# EAGLE design prot-pic24-mtouch+tft-rev2 (EAGLE 6.2)
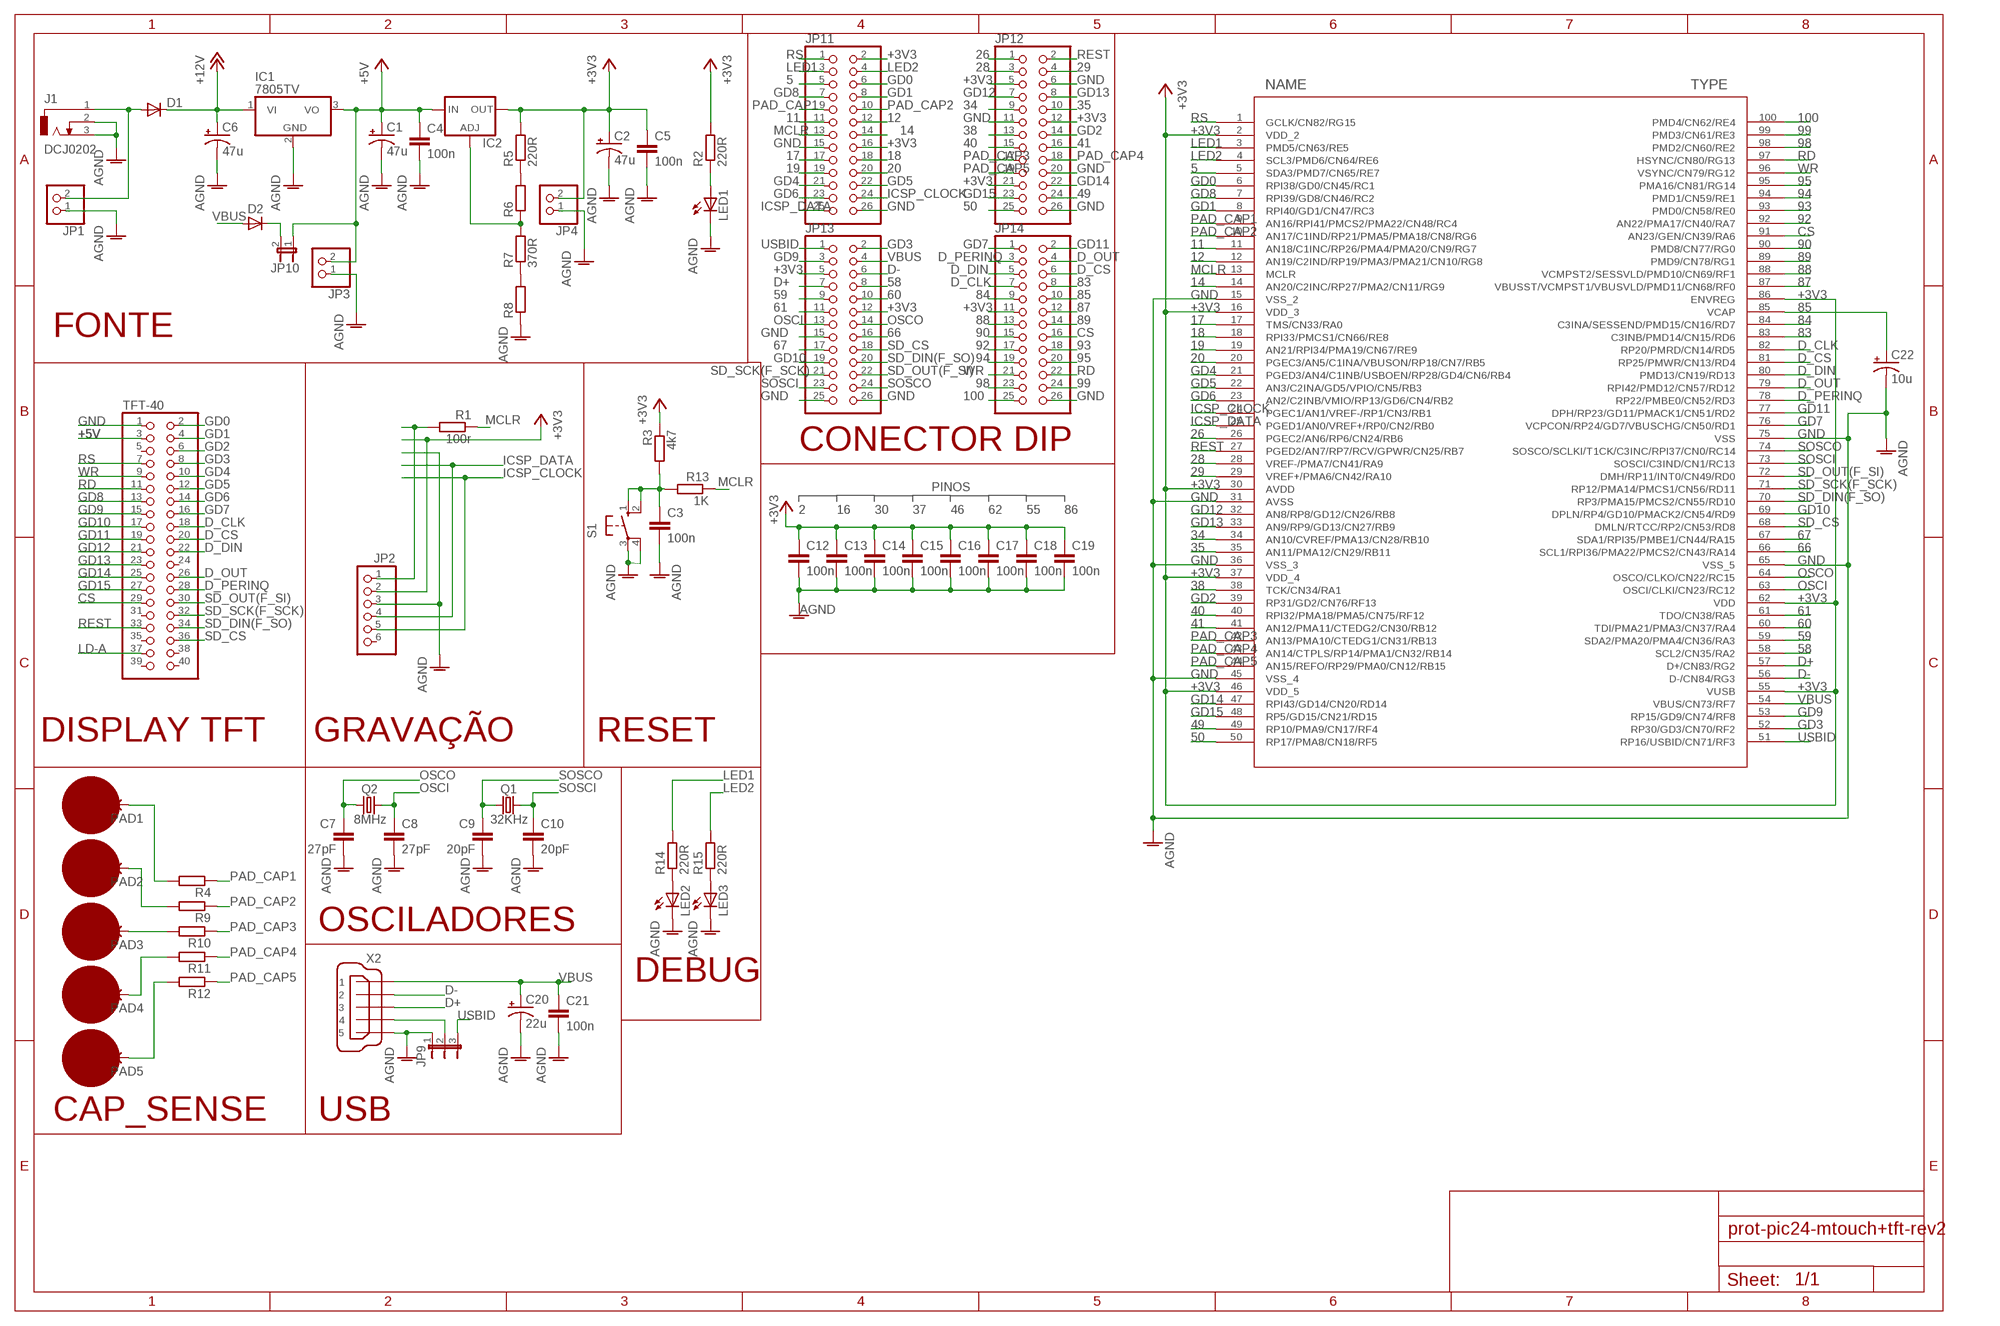
[diagram p0: schematic, sheet 1]

## Parts
C1  47u  CPOL-USE2.5-5  [E2,5-5]
C2  47u  CPOL-USE2.5-5  [E2,5-5]
C3  100n  C-EU050-025X075  [C050-025X075]
C4  100n  C-EU025-030X050  [C025-030X050]
C5  100n  C-EU025-030X050  [C025-030X050]
C6  47u  CPOL-USE2.5-5  [E2,5-5]
C7  27pF  C-EU025-030X050  [C025-030X050]
C8  27pF  C-EU025-030X050  [C025-030X050]
C9  20pF  C-EU025-030X050  [C025-030X050]
C10  20pF  C-EU025-030X050  [C025-030X050]
C12  100n  C-EU025-025X050  [C025-025X050]
C13  100n  C-EU025-030X050  [C025-030X050]
C14  100n  C-EU025-030X050  [C025-030X050]
C15  100n  C-EU025-030X050  [C025-030X050]
C16  100n  C-EU025-030X050  [C025-030X050]
C17  100n  C-EU025-030X050  [C025-030X050]
C18  100n  C-EU025-030X050  [C025-030X050]
C19  100n  C-EU025-030X050  [C025-030X050]
C20  22u  CPOL-USE2.5-5  [E2,5-5]
C21  100n  C-EU025-030X050  [C025-030X050]
C22  10u  CPOL-USE2.5-5  [E2,5-5]
D1  DIODE-D-5  [D-5]
D2  DIODE-D-5  [D-5]
IC1  7805TV  [TO220V]
IC2  LM317TS  [317TS]
J1  DCJ0202  [DCJ0202]
JP1  PINHD-1X2  [1X02]
JP2  PINHD-1X6  [1X06]
JP3  PINHD-1X2  [1X02]
JP4  PINHD-1X2  [1X02]
JP9  JP2E  [JP2]
JP10  JP1E  [JP1]
JP11  PINHD-2X13  [2X13]
JP12  PINHD-2X13  [2X13]
JP13  PINHD-2X13  [2X13]
JP14  PINHD-2X13  [2X13]
LED1  LED3MM  [LED3MM]
LED2  LED3MM  [LED3MM]
LED3  LED3MM  [LED3MM]
PAD1  SMD5  [SMD2,54-5,08]
PAD2  SMD5  [SMD2,54-5,08]
PAD3  SMD5  [SMD2,54-5,08]
PAD4  SMD5  [SMD2,54-5,08]
PAD5  SMD5  [SMD2,54-5,08]
Q1  32KHz  CRYSTALTC26V  [TC26V]
Q2  8MHz  CRYSTALHC49S  [HC49/S]
R1  100r  R-EU_0204/2V  [0204V]
R2  220R  R-EU_0204/2V  [0204V]
R3  4k7  R-EU_0204/2V  [0204V]
R4  220R  R-EU_0204/2V  [0204V]
R5  220R  R-EU_0204/2V  [0204V]
R6  R-EU_0204/2V  [0204V]
R7  370R  R-EU_0204/2V  [0204V]
R8  R-EU_0204/2V  [0204V]
R9  220R  R-EU_0204/2V  [0204V]
R10  220R  R-EU_0204/2V  [0204V]
R11  220R  R-EU_0204/2V  [0204V]
R12  220R  R-EU_0204/2V  [0204V]
R13  1K  R-EU_0204/2V  [0204V]
R14  220R  R-EU_0204/2V  [0204V]
R15  220R  R-EU_0204/2V  [0204V]
S1  10-XX  [B3F-10XX]
TFT-40  PINHD-2X20  [2X20]
U$1  PIC24FJXXXDAX10_  [TQFP100_12X12MC]
X2  MINI-USB-32005-301  [32005-301]

## Nets
5: JP11.5 U$1.5(SDA3/PMD7/CN65/RE7)
11: JP11.11 U$1.11(AN18/C1INC/RP26/PMA4/PMA20/CN9/RG7)
12: JP11.12 U$1.12(AN19/C2IND/RP19/PMA3/PMA21/CN10/RG8)
14: JP11.14 U$1.14(AN20/C2INC/RP27/PMA2/CN11/RG9)
17: JP11.17 U$1.17(TMS/CN33/RA0)
18: JP11.18 U$1.18(RPI33/PMCS1/CN66/RE8)
19: JP11.19 U$1.19(AN21/RPI34/PMA19/CN67/RE9)
20: JP11.20 U$1.20(PGEC3/AN5/C1INA/VBUSON/RP18/CN7/RB5)
26: JP12.1 U$1.26(PGEC2/AN6/RP6/CN24/RB6)
28: JP12.3 U$1.28(VREF-/PMA7/CN41/RA9)
29: JP12.4 U$1.29(VREF+/PMA6/CN42/RA10)
34: JP12.9 U$1.34(AN10/CVREF/PMA13/CN28/RB10)
35: JP12.10 U$1.35(AN11/PMA12/CN29/RB11)
38: JP12.13 U$1.38(TCK/CN34/RA1)
40: JP12.15 U$1.40(RPI32/PMA18/PMA5/CN75/RF12)
41: JP12.16 U$1.41(AN12/PMA11/CTEDG2/CN30/RB12)
49: JP12.24 U$1.49(RP10/PMA9/CN17/RF4)
50: JP12.25 U$1.50(RP17/PMA8/CN18/RF5)
58: JP13.8 U$1.58(SCL2/CN35/RA2)
59: JP13.9 U$1.59(SDA2/PMA20/PMA4/CN36/RA3)
60: JP13.10 U$1.60(TDI/PMA21/PMA3/CN37/RA4)
61: JP13.11 U$1.61(TDO/CN38/RA5)
66: JP13.16 U$1.66(SCL1/RPI36/PMA22/PMCS2/CN43/RA14)
67: JP13.17 U$1.67(SDA1/RPI35/PMBE1/CN44/RA15)
83: JP14.8 U$1.83(C3INB/PMD14/CN15/RD6)
84: JP14.9 U$1.84(C3INA/SESSEND/PMD15/CN16/RD7)
85: C22.+ JP14.10 U$1.85(VCAP)
87: JP14.12 U$1.87(VBUSST/VCMPST1/VBUSVLD/PMD11/CN68/RF0)
88: JP14.13 U$1.88(VCMPST2/SESSVLD/PMD10/CN69/RF1)
89: JP14.14 U$1.89(PMD9/CN78/RG1)
90: JP14.15 U$1.90(PMD8/CN77/RG0)
92: JP14.17 U$1.92(AN22/PMA17/CN40/RA7)
93: JP14.18 U$1.93(PMD0/CN58/RE0)
94: JP14.19 U$1.94(PMD1/CN59/RE1)
95: JP14.20 U$1.95(PMA16/CN81/RG14)
98: JP14.23 U$1.98(PMD2/CN60/RE2)
99: JP14.24 U$1.99(PMD3/CN61/RE3)
100: JP14.25 U$1.100(PMD4/CN62/RE4)
+3V3: C2.+ C5.1 C12.1 C13.1 C14.1 C15.1 C16.1 C17.1 C18.1 C19.1 IC2.2(OUT) JP2.2 JP4.2 JP11.2 JP11.16 JP12.5 JP12.12 JP12.21 JP13.5 JP13.12 JP14.11 R2.2 R3.1 R5.2 U$1.2(VDD_2) U$1.16(VDD_3) U$1.30(AVDD) U$1.37(VDD_4) U$1.46(VDD_5) U$1.55(VUSB) U$1.62(VDD) U$1.86(ENVREG)
+5V: C1.+ C4.1 IC1.3(VO) IC2.3(IN) JP3.2 JP10.1 TFT-40.3
+12V: C6.+ D1.C IC1.1(VI)
AGND: LED2.K(C) LED3.K(C)
CS: JP14.16 TFT-40.29 U$1.91(AN23/GEN/CN39/RA6)
D+: JP13.7 U$1.57(D+/CN83/RG2) X2.3
D-: JP13.6 U$1.56(D-/CN84/RG3) X2.2
D_CLK: JP14.7 TFT-40.18 U$1.82(RP20/PMRD/CN14/RD5)
D_CS: JP14.6 TFT-40.20 U$1.81(RP25/PMWR/CN13/RD4)
D_DIN: JP14.5 TFT-40.22 U$1.80(PMD13/CN19/RD13)
D_OUT: JP14.4 TFT-40.26 U$1.79(RPI42/PMD12/CN57/RD12)
D_PERINQ: JP14.3 TFT-40.28 U$1.78(RP22/PMBE0/CN52/RD3)
GD0: JP11.6 TFT-40.2 U$1.6(RPI38/GD0/CN45/RC1)
GD1: JP11.8 TFT-40.4 U$1.8(RPI40/GD1/CN47/RC3)
GD2: JP12.14 TFT-40.6 U$1.39(RP31/GD2/CN76/RF13)
GD3: JP13.2 TFT-40.8 U$1.52(RP30/GD3/CN70/RF2)
GD4: JP11.21 TFT-40.10 U$1.21(PGED3/AN4/C1INB/USBOEN/RP28/GD4/CN6/RB4)
GD5: JP11.22 TFT-40.12 U$1.22(AN3/C2INA/GD5/VPIO/CN5/RB3)
GD6: JP11.23 TFT-40.14 U$1.23(AN2/C2INB/VMIO/RP13/GD6/CN4/RB2)
GD7: JP14.1 TFT-40.16 U$1.76(VCPCON/RP24/GD7/VBUSCHG/CN50/RD1)
GD8: JP11.7 TFT-40.13 U$1.7(RPI39/GD8/CN46/RC2)
GD9: JP13.3 TFT-40.15 U$1.53(RP15/GD9/CN74/RF8)
GD10: JP13.19 TFT-40.17 U$1.69(DPLN/RP4/GD10/PMACK2/CN54/RD9)
GD11: JP14.2 TFT-40.19 U$1.77(DPH/RP23/GD11/PMACK1/CN51/RD2)
GD12: JP12.7 TFT-40.21 U$1.32(AN8/RP8/GD12/CN26/RB8)
GD13: JP12.8 TFT-40.23 U$1.33(AN9/RP9/GD13/CN27/RB9)
GD14: JP12.22 TFT-40.25 U$1.47(RPI43/GD14/CN20/RD14)
GD15: JP12.23 TFT-40.27 U$1.48(RP5/GD15/CN21/RD15)
GND: C1.- C2.- C3.2 C4.2 C5.2 C6.- C7.2 C8.2 C9.2 C10.2 C12.2 C13.2 C14.2 C15.2 C16.2 C17.2 C18.2 C19.2 C20.- C21.2 C22.- IC1.2(GND) J1.2 J1.3 JP1.1 JP2.3 JP3.1 JP4.1 JP9.1 JP11.15 JP11.26 JP12.6 JP12.11 JP12.20 JP12.26 JP13.15 JP13.25 JP13.26 JP14.26 LED1.K(C) R8.1 S1.3(P) S1.4(P1) TFT-40.1 U$1.15(VSS_2) U$1.31(AVSS) U$1.36(VSS_3) U$1.45(VSS_4) U$1.65(VSS_5) U$1.75(VSS) X2.5 ; supply symbol labelled AGND
ICSP_CLOCK: JP2.5 JP11.24 U$1.24(PGEC1/AN1/VREF-/RP1/CN3/RB1)
ICSP_DATA: JP2.4 JP11.25 U$1.25(PGED1/AN0/VREF+/RP0/CN2/RB0)
LD-A: TFT-40.37
LED1: JP11.3 R14.2 U$1.3(PMD5/CN63/RE5)
LED2: JP11.4 R15.2 U$1.4(SCL3/PMD6/CN64/RE6)
MCLR: JP11.13 R1.1 R13.1 U$1.13(MCLR)
N$1: D1.A J1.1 JP1.2
N$2: LED1.A R2.1
N$3: JP2.1 R1.2
N$4: R5.1 R6.2
N$5: IC2.1(ADJ) R6.1 R7.2
N$6: R7.1 R8.2
N$7: PAD1.1(P) R4.2
N$8: JP9.2 X2.4
N$9: PAD2.1(P) R9.2
N$10: PAD3.1(P) R10.2
N$11: PAD4.1(P) R11.2
N$12: PAD5.1(P) R12.2
N$13: C3.1 R3.2 R13.2 S1.1(S) S1.2(S1)
N$14: LED2.A R14.1
N$15: D2.C JP10.2
N$16: LED3.A R15.1
OSCI: C8.1 JP13.13 Q2.2 U$1.63(OSCI/CLKI/CN23/RC12)
OSCO: C7.1 JP13.14 Q2.1 U$1.64(OSCO/CLKO/CN22/RC15)
PAD_CAP1: JP11.9 R4.1 U$1.9(AN16/RPI41/PMCS2/PMA22/CN48/RC4)
PAD_CAP2: JP11.10 R9.1 U$1.10(AN17/C1IND/RP21/PMA5/PMA18/CN8/RG6)
PAD_CAP3: JP12.17 R10.1 U$1.42(AN13/PMA10/CTEDG1/CN31/RB13)
PAD_CAP4: JP12.18 R11.1 U$1.43(AN14/CTPLS/RP14/PMA1/CN32/RB14)
PAD_CAP5: JP12.19 R12.1 U$1.44(AN15/REFO/RP29/PMA0/CN12/RB15)
RD: JP14.22 TFT-40.11 U$1.97(HSYNC/CN80/RG13)
REST: JP12.2 TFT-40.33 U$1.27(PGED2/AN7/RP7/RCV/GPWR/CN25/RB7)
RS: JP11.1 TFT-40.7 U$1.1(GCLK/CN82/RG15)
SD_CS: JP13.18 TFT-40.36 U$1.68(DMLN/RTCC/RP2/CN53/RD8)
SD_DIN(F_SO): JP13.20 TFT-40.34 U$1.70(RP3/PMA15/PMCS2/CN55/RD10)
SD_OUT(F_SI): JP13.22 TFT-40.30 U$1.72(DMH/RP11/INT0/CN49/RD0)
SD_SCK(F_SCK): JP13.21 TFT-40.32 U$1.71(RP12/PMA14/PMCS1/CN56/RD11)
SOSCI: C10.1 JP13.23 Q1.2 U$1.73(SOSCI/C3IND/CN1/RC13)
SOSCO: C9.1 JP13.24 Q1.1 U$1.74(SOSCO/SCLKI/T1CK/C3INC/RPI37/CN0/RC14)
USBID: JP9.3 JP13.1 U$1.51(RP16/USBID/CN71/RF3)
VBUS: C20.+ C21.1 D2.A JP13.4 U$1.54(VBUS/CN73/RF7) X2.1
WR: JP14.21 TFT-40.9 U$1.96(VSYNC/CN79/RG12)
Unconnected: JP2.6 TFT-40.5 TFT-40.24 TFT-40.31 TFT-40.35 TFT-40.38 TFT-40.39 TFT-40.40

## Notes on the sheet
- FONTE
- CONECTOR DIP
- PINOS
- 2 | 16 | 30 | 37 | 46 | 62 | 55 | 86
- DISPLAY TFT | GRAVAÇÃO | RESET
- OSCILADORES
- DEBUG
- CAP_SENSE | USB

## Library data of the parts
C1 C2 C6 C20 C22 = rcl:CPOL-US: POLARIZED CAPACITOR, American symbol
C3-C5 C7-C10 C12-C19 C21 = rcl:C-EU: CAPACITOR, European symbol
D1 D2 = diode:DIODE-: DIODE
IC1 = linear:78*: Positive VOLTAGE REGULATOR Source: http://cache.national.com/ds/LM/LM78L05.pdf http://www.fairchildsemi.com/ds/LM/LM7805.pdf
IC2 = v-reg:LM317TS: VOLTAGE REGULATOR
J1 = con-jack:DCJ0202: DC POWER JACK Source: DCJ0202.pdf; OC_FARNELL: unknown; OC_NEWARK: unknown
JP1 JP3 JP4 = pinhead:PINHD-1X2: PIN HEADER
JP2 = pinhead:PINHD-1X6: PIN HEADER
JP9 = jumper:JP2E: JUMPER
JP10 = jumper:JP1E: JUMPER
JP11-JP14 = pinhead:PINHD-2X13: PIN HEADER
LED1-LED3 = led:LED: LED OSRAM: - CHIPLED LG R971, LG N971, LY N971, LG Q971, LY Q971, LO R971, LY R971 LH N974, LH R974 LS Q976, LO Q976, LY Q976 LO Q996 - Hyper CHIPLED LW Q18S LB Q993, LB Q99A, LB R99A - SideLED LS A670, LO A670, LY A670, LG A670, LP A670 LB A673, LV A673, LT A673, LW A673 LH A674 LY A675 LS A676, LA A676, LO A676, LY A676, LW A676 LS A679, LY A679, LG A679 - Hyper Micro SIDELED® LS Y876, LA Y876, LO Y876, LY Y876 LT Y87S - SmartLED LW L88C, LW L88S LB L89C, LB L89S, LG L890 LS L89K, LO L89K, LY L89K LS L896, LA L896, LO L896, LY L896 - TOPLED LS T670, LO T670, LY T670, LG T670, LP T670 LSG T670, LSP T670, LSY T670, LOP T670, LYG T670 LG T671, LOG T671, LSG T671 LB T673, LV T673, LT T673, LW T673 LH T674 LS T676, LA T676, LO T676, LY T676, LB T676, LH T676, LSB T676, LW T676 LB T67C, LV T67C, LT T67C, LS T67K, LO T67K, LY T67K, LW E67C LS E67B, LA E67B, LO E67B, LY E67B, LB E67C, LV E67C, LT E67C LW T67C LS T679, LY T679, LG T679 LS T770, LO T770, LY T770, LG T770, LP T770 LB T773, LV T773, LT T773, LW T773 LH T774 LS E675, LA E675, LY E675, LS T675 LS T776, LA T776, LO T776, LY T776, LB T776 LHGB T686 LT T68C, LB T68C - Hyper Mini TOPLED® LB M676 - Mini TOPLED Santana® LG M470 LS M47K, LO M47K, LY M47K Source: http://www.osram.convergy.de LUXEON: - LUMILED® LXK2-PW12-R00, LXK2-PW12-S00, LXK2-PW14-U00, LXK2-PW14-V00 LXK2-PM12-R00, LXK2-PM12-S00, LXK2-PM14-U00 LXK2-PE12-Q00, LXK2-PE12-R00, LXK2-PE12-S00, LXK2-PE14-T00, LXK2-PE14-U00 LXK2-PB12-K00, LXK2-PB12-L00, LXK2-PB12-M00, LXK2-PB14-N00, LXK2-PB14-P00, LXK2-PB14-Q00 LXK2-PR12-L00, LXK2-PR12-M00, LXK2-PR14-Q00, LXK2-PR14-R00 LXK2-PD12-Q00, LXK2-PD12-R00, LXK2-PD12-S00 LXK2-PH12-R00, LXK2-PH12-S00 LXK2-PL12-P00, LXK2-PL12-Q00, LXK2-PL12-R00 Source: www.luxeon.com KINGBRIGHT: KA-3528ASYC Source: www.kingbright.com
PAD1-PAD5 = wirepad:SMD5: SMD PAD
Q1 = crystal:CRYSTAL: CRYSTAL; OC_FARNELL: unknown; OC_NEWARK: unknown
Q2 = crystal:CRYSTAL: CRYSTAL; OC_FARNELL: 1667008; OC_NEWARK: unknown
R1-R15 = rcl:R-EU_: RESISTOR, European symbol
S1 = switch-omron:10-XX: OMRON SWITCH; MPN: B3F-1000; OC_FARNELL: 176432; OC_NEWARK: 36M3542
TFT-40 = pinhead:PINHD-2X20: PIN HEADER
U$1 = PIC24FJ256TESTE:PIC24FJXXXDAX10_
X2 = con-cypressindustries:MINI-USB-: MINI USB-B Conector Source: www.cypressindustries.com; OC_FARNELL: unknown; OC_NEWARK: unknown

## Board
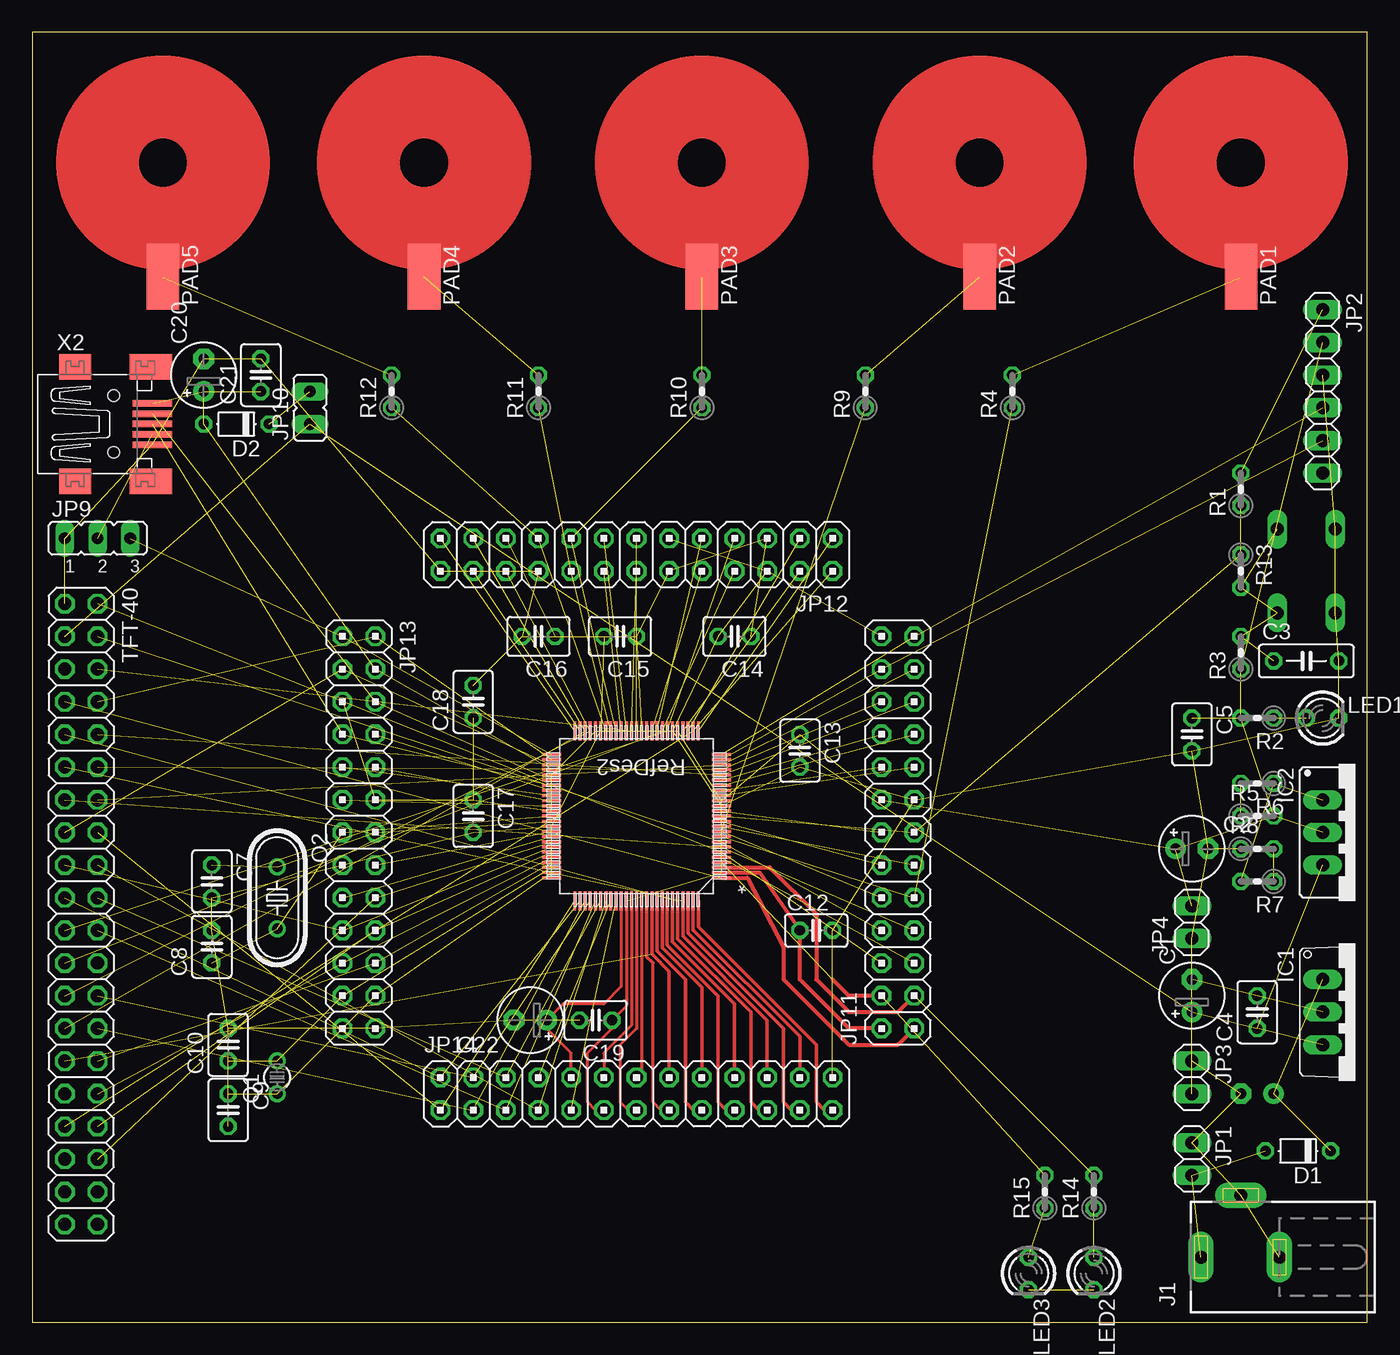
[diagram p1: board, top side]
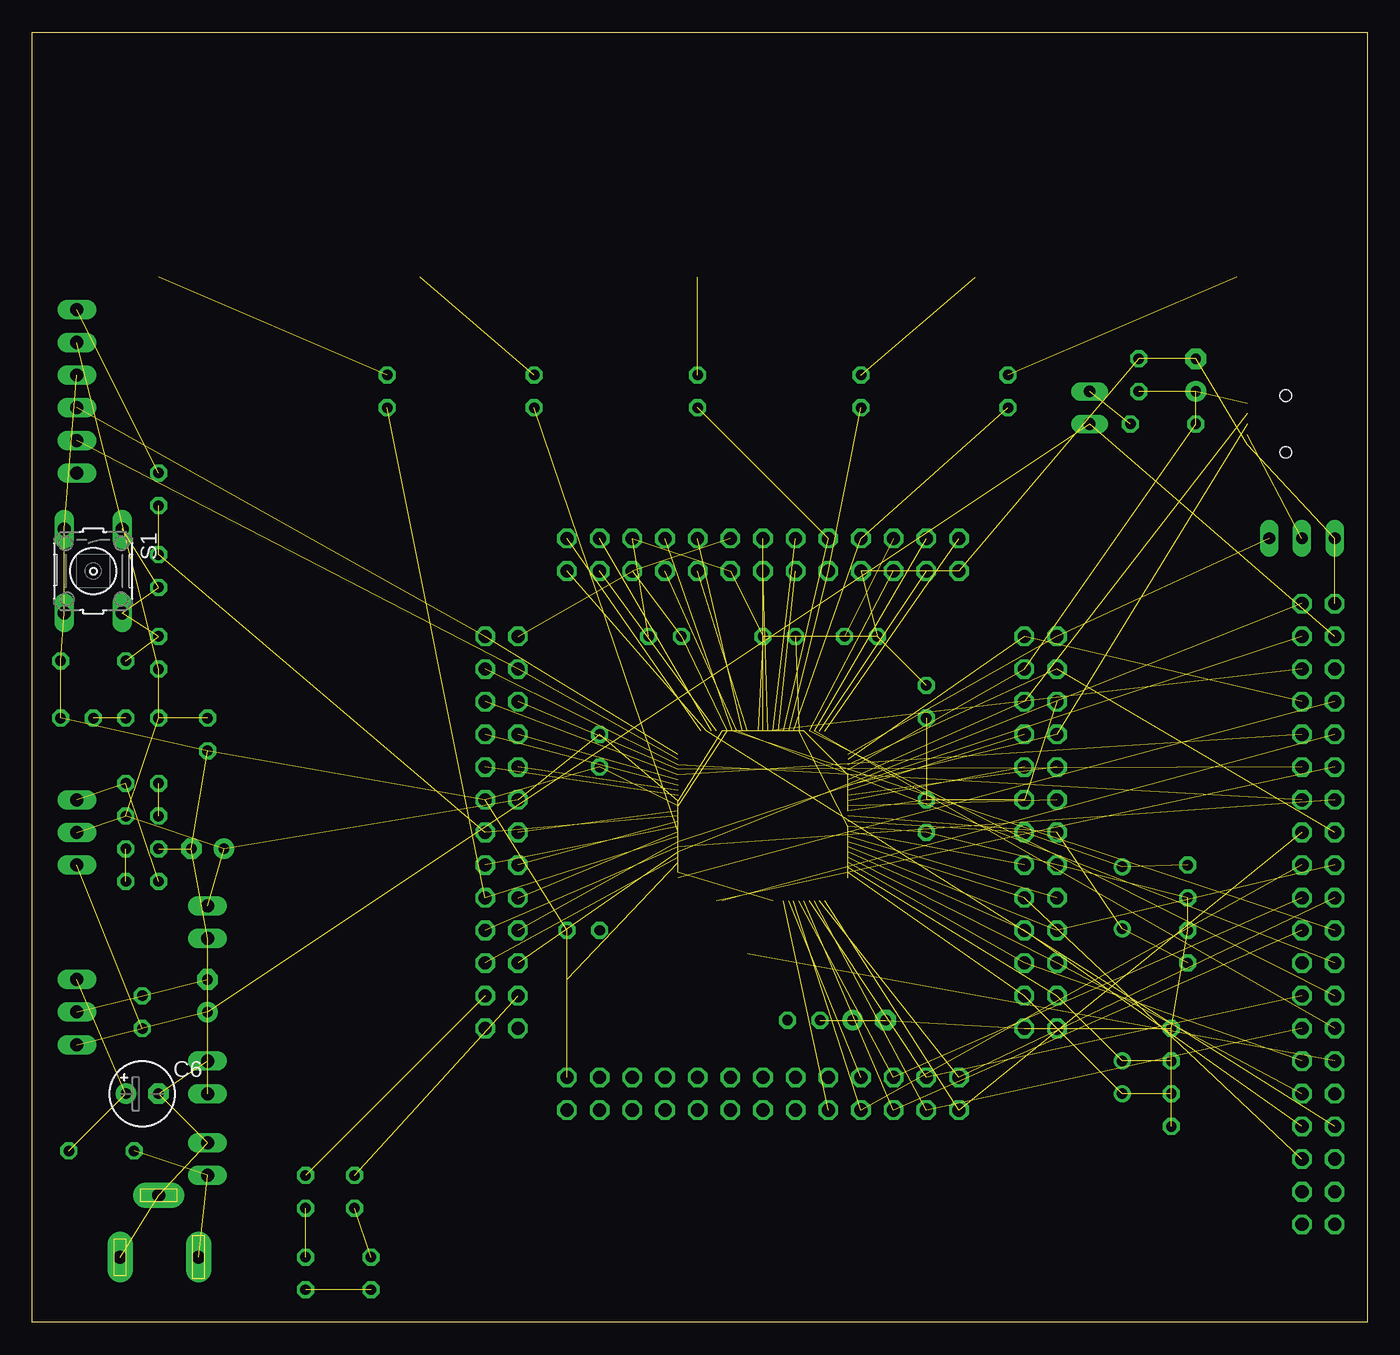
[diagram p2: board, bottom side, seen from below]

Size 103.81 x 100.32 mm. Coordinates in mm from the lower left corner, seen from the top.
Outline: 0,0 103.81,0 103.81,100.32 0,100.32 0,0
Copper layers (1*16): Top 0.035mm / dielectric 1.5mm / Bottom 0.035mm
Design rules: minimum track width 10mil, minimum drill 24mil, track to track 4mil, track to pad 8mil, pad to pad 8mil, via to via 8mil, smd to smd 8mil, copper to edge 40mil, drill to drill 8mil, minimum pad ring 10mil, minimum via ring 8mil, stop-mask expansion 4mil, vias tented up to drill 0mil, thermal gap 10mil

### Footprints (pad centres in the part's own frame; a part is rotated, then mirrored left to right if it is on the bottom)
E2,5-5 = drill 0.813 pad 1.6: + -1.27,0 | drill 0.813 pad 1.6 octagon: - 1.27,0
C050-025X075 = drill 0.813 octagon: 1 -2.54,0; 2 2.54,0
C025-030X050 = drill 0.813 octagon: 1 -1.27,0; 2 1.27,0
C025-025X050 = drill 0.813 octagon: 1 -1.27,0; 2 1.27,0
D-5 = drill 0.813 octagon: A 2.54,0; C -2.54,0
TO220V = drill 1.016 long: 1 -2.54,-2.54; 2 0,-2.54; 3 2.54,-2.54
317TS = drill 1.016 long: 1 -2.54,-2.54; 2 0,-2.54; 3 2.54,-2.54
DCJ0202 = drill 1 pad 2 long: 1 0,3.1; 2 4.8,0; 3 0,-3
1X02 = drill 1.016 long: 1 -1.27,0; 2 1.27,0
1X06 = drill 1.016 long: 1 -6.35,0; 2 -3.81,0; 3 -1.27,0; 4 1.27,0; 5 3.81,0; 6 6.35,0
JP2 = drill 0.914 long: 1 -2.54,0; 2 0,0; 3 2.54,0
JP1 = drill 0.914 long: 1 0,-1.27; 2 0,1.27
2X13 = drill 1.016 octagon: 1 -15.24,-1.27; 2 -15.24,1.27; 3 -12.7,-1.27; 4 -12.7,1.27; 5 -10.16,-1.27; 6 -10.16,1.27; 7 -7.62,-1.27; 8 -7.62,1.27; 9 -5.08,-1.27; 10 -5.08,1.27; 11 -2.54,-1.27; 12 -2.54,1.27; 13 0,-1.27; 14 0,1.27; 15 2.54,-1.27; 16 2.54,1.27; 17 5.08,-1.27; 18 5.08,1.27; 19 7.62,-1.27; 20 7.62,1.27; 21 10.16,-1.27; 22 10.16,1.27; 23 12.7,-1.27; 24 12.7,1.27; 25 15.24,-1.27; 26 15.24,1.27
LED3MM = drill 0.813 octagon: A -1.27,0; K 1.27,0
SMD2,54-5,08 = smd 2.54 x 5.08: 1 0,0
TC26V = drill 0.813: 1 -1.27,0; 2 1.27,0
HC49/S = drill 0.813: 1 -2.413,0; 2 2.413,0
0204V = drill 0.813 octagon: 1 -1.27,0; 2 1.27,0
B3F-10XX = drill 1.016 long: 1 -3.251,2.261; 2 3.251,2.261; 3 -3.251,-2.261; 4 3.251,-2.261
2X20 = drill 1.016 octagon: 1 -24.13,-1.27; 2 -24.13,1.27; 3 -21.59,-1.27; 4 -21.59,1.27; 5 -19.05,-1.27; 6 -19.05,1.27; 7 -16.51,-1.27; 8 -16.51,1.27; 9 -13.97,-1.27; 10 -13.97,1.27; 11 -11.43,-1.27; 12 -11.43,1.27; 13 -8.89,-1.27; 14 -8.89,1.27; 15 -6.35,-1.27; 16 -6.35,1.27; 17 -3.81,-1.27; 18 -3.81,1.27; 19 -1.27,-1.27; 20 -1.27,1.27; 21 1.27,-1.27; 22 1.27,1.27; 23 3.81,-1.27; 24 3.81,1.27; 25 6.35,-1.27; 26 6.35,1.27; 27 8.89,-1.27; 28 8.89,1.27; 29 11.43,-1.27; 30 11.43,1.27; 31 13.97,-1.27; 32 13.97,1.27; 33 16.51,-1.27; 34 16.51,1.27; 35 19.05,-1.27; 36 19.05,1.27; 37 21.59,-1.27; 38 21.59,1.27; 39 24.13,-1.27; 40 24.13,1.27
TQFP100_12X12MC = smd 1.473 x 0.229: 1 -6.604,4.801; 2 -6.604,4.394; 3 -6.604,3.988; 4 -6.604,3.607; 5 -6.604,3.2; 6 -6.604,2.794; 7 -6.604,2.388; 8 -6.604,2.007; 9 -6.604,1.6; 10 -6.604,1.194; 11 -6.604,0.787; 12 -6.604,0.406; 13 -6.604,0; 14 -6.604,-0.406; 15 -6.604,-0.787; 16 -6.604,-1.194; 17 -6.604,-1.6; 18 -6.604,-2.007; 19 -6.604,-2.388; 20 -6.604,-2.794; 21 -6.604,-3.2; 22 -6.604,-3.607; 23 -6.604,-3.988; 24 -6.604,-4.394; 25 -6.604,-4.801; 51 6.604,-4.801; 52 6.604,-4.394; 53 6.604,-3.988; 54 6.604,-3.607; 55 6.604,-3.2; 56 6.604,-2.794; 57 6.604,-2.388; 58 6.604,-2.007; 59 6.604,-1.6; 60 6.604,-1.194; 61 6.604,-0.787; 62 6.604,-0.406; 63 6.604,0; 64 6.604,0.406; 65 6.604,0.787; 66 6.604,1.194; 67 6.604,1.6; 68 6.604,2.007; 69 6.604,2.388; 70 6.604,2.794; 71 6.604,3.2; 72 6.604,3.607; 73 6.604,3.988; 74 6.604,4.394; 75 6.604,4.801 | smd 0.229 x 1.473: 26 -4.801,-6.604; 27 -4.394,-6.604; 28 -3.988,-6.604; 29 -3.607,-6.604; 30 -3.2,-6.604; 31 -2.794,-6.604; 32 -2.388,-6.604; 33 -2.007,-6.604; 34 -1.6,-6.604; 35 -1.194,-6.604; 36 -0.787,-6.604; 37 -0.406,-6.604; 38 0,-6.604; 39 0.406,-6.604; 40 0.787,-6.604; 41 1.194,-6.604; 42 1.6,-6.604; 43 2.007,-6.604; 44 2.388,-6.604; 45 2.794,-6.604; 46 3.2,-6.604; 47 3.607,-6.604; 48 3.988,-6.604; 49 4.394,-6.604; 50 4.801,-6.604; 76 4.801,6.604; 77 4.394,6.604; 78 3.988,6.604; 79 3.607,6.604; 80 3.2,6.604; 81 2.794,6.604; 82 2.388,6.604; 83 2.007,6.604; 84 1.6,6.604; 85 1.194,6.604; 86 0.787,6.604; 87 0.406,6.604; 88 0,6.604; 89 -0.406,6.604; 90 -0.787,6.604; 91 -1.194,6.604; 92 -1.6,6.604; 93 -2.007,6.604; 94 -2.388,6.604; 95 -2.794,6.604; 96 -3.2,6.604; 97 -3.607,6.604; 98 -3.988,6.604; 99 -4.394,6.604; 100 -4.801,6.604
32005-301 = smd 3.1 x 0.5: 1 3,1.6; 2 3,0.8; 3 3,0; 4 3,-0.8; 5 3,-1.6 | smd 2.5 x 2: M1 -3,-4.45; M2 -3,4.45 | smd 3.3 x 2: M3 2.9,4.45; M4 2.9,-4.45 | hole 0.9: 0,2.2; 0,-2.2

### Placement (x,y rotation side)
C1  90.17,25.4 90 top
C2  90.17,36.83 0 top
C3  99.06,51.44 0 top
C4  95.25,24.13 90 top
C5  90.17,45.72 270 top
C6  95.25,17.78 0 bottom
C7  13.97,34.29 270 top
C8  13.97,29.21 90 top
C9  15.24,16.51 270 top
C10  15.24,21.59 90 top
C12  60.96,30.48 0 top
C13  59.69,44.45 270 top
C14  54.61,53.34 180 top
C15  45.72,53.34 180 top
C16  39.37,53.34 180 top
C17  34.29,39.37 270 top
C18  34.29,48.26 90 top
C19  43.81,23.5 180 top
C20  13.34,73.66 90 top
C21  17.78,73.66 90 top
C22  38.73,23.5 180 top
D1  98.42,13.34 180 top
D2  15.88,69.85 180 top
IC1  102.87,24.13 270 top
IC2  102.87,38.1 270 top
J1  93.98,5.08 90 top
JP1  90.17,12.7 270 top
JP2  100.33,72.39 270 top
JP3  90.17,19.05 270 top
JP4  90.17,31.11 90 top
JP9  5.08,60.96 0 top
JP10  21.59,71.12 0 top
JP11  67.31,38.1 90 top
JP12  46.99,59.69 180 top
JP13  25.4,38.1 270 top
JP14  46.99,17.78 0 top
LED1  100.33,46.99 0 top
LED2  82.55,3.81 270 top
LED3  77.47,3.81 270 top
PAD1  93.98,81.28 180 top
PAD2  73.66,81.28 180 top
PAD3  52.07,81.28 180 top
PAD4  30.48,81.28 180 top
PAD5  10.16,81.28 180 top
Q1  19.05,19.05 90 top
Q2  19.05,33.02 270 top
R1  93.98,64.77 90 top
R2  95.25,46.99 180 top
R3  93.98,52.07 90 top
R4  76.2,72.39 90 top
R5  95.25,39.37 0 top
R6  95.25,41.91 180 top
R7  95.25,34.29 180 top
R8  95.25,36.83 0 top
R9  64.77,72.39 90 top
R10  52.07,72.39 90 top
R11  39.37,72.39 90 top
R12  27.94,72.39 90 top
R13  93.98,58.42 270 top
R14  82.55,10.16 90 top
R15  78.74,10.16 90 top
S1  99.06,58.42 270 bottom
TFT-40  3.81,31.75 270 top
U$1  46.99,39.37 180 top
X2  6.35,69.85 0 top

### Tracks (layer width: path | path; a pad name or v marks a point on that pad's centre or on a via)
5  (1 unrouted)
11  (1 unrouted)
12  (1 unrouted)
14  (1 unrouted)
17  (1 unrouted)
18  (1 unrouted)
19  (1 unrouted)
20  (1 unrouted)
26  (1 unrouted)
28  (1 unrouted)
29  (1 unrouted)
34  (1 unrouted)
35  (1 unrouted)
38  (1 unrouted)
40  (1 unrouted)
41  (1 unrouted)
49  (1 unrouted)
50  (1 unrouted)
58  (1 unrouted)
59  (1 unrouted)
60  (1 unrouted)
61  (1 unrouted)
66  (1 unrouted)
67  (1 unrouted)
83  (1 unrouted)
84  (1 unrouted)
85
  Top 0.25: U$1.85 45.8,26.11 44.45,24.77 41.27,24.77 C22.+ 40.01,22.86 41.91,20.95 JP14.10
87
  Top 0.25: U$1.87 46.58,23.09 44.45,20.95 JP14.12
88
  Top 0.25: U$1.88 46.99,22.86 45.72,21.59 45.72,17.14 46.35,16.51 JP14.13
89
  Top 0.25: U$1.89 47.4,19.46 JP14.14
90
  Top 0.25: JP14.15 48.9,16.51 48.26,17.14 48.26,27.94
  Top 0.254: U$1.90 47.78,28.42 48.26,27.94
92
  Top 0.254: U$1.92 48.59,28.88 50.8,26.67 50.8,17.14 51.44,16.51 JP14.17
93
  Top 0.254: U$1.93 49,29.11 52.07,26.04 JP14.18
94
  Top 0.254: U$1.94 49.38,29.36 53.34,25.4 53.34,17.14 53.98,16.51 JP14.19
95
  Top 0.254: U$1.95 49.78,29.59 54.61,24.77 JP14.20
98
  Top 0.254: U$1.98 50.98,30.3 58.42,22.86 58.42,17.14 59.05,16.51 JP14.23
99
  Top 0.254: U$1.99 51.38,30.53 59.69,22.23 JP14.24
100
  Top 0.254: U$1.100 51.79,30.76 60.96,21.59 60.96,17.14 61.59,16.51 JP14.25
+3V3  (27 unrouted)
  Top 0.25: U$1.86 46.2,24.61 C19.1 45.09,22.86 43.18,20.95 43.18,17.14 43.81,16.51 JP14.11
  Top 0.305: U$1.2 56.57,34.98 C12.1 59.69,26.67 63.5,22.86 JP11.2
+5V  (6 unrouted)
+12V  (2 unrouted)
AGND  (1 unrouted)
CS  (1 unrouted)
  Top 0.254: U$1.91 48.18,28.65 49.53,27.3 JP14.16
D+  (2 unrouted)
D-  (2 unrouted)
D_CLK  (2 unrouted)
D_CS  (2 unrouted)
D_DIN  (2 unrouted)
D_OUT  (2 unrouted)
D_PERINQ  (2 unrouted)
GD0  (2 unrouted)
GD1  (2 unrouted)
GD2  (2 unrouted)
GD3  (2 unrouted)
GD4  (2 unrouted)
GD5  (2 unrouted)
GD6  (2 unrouted)
GD7  (2 unrouted)
GD8  (2 unrouted)
GD9  (2 unrouted)
GD10  (2 unrouted)
GD11  (2 unrouted)
GD12  (2 unrouted)
GD13  (2 unrouted)
GD14  (2 unrouted)
GD15  (2 unrouted)
GND  (50 unrouted)
ICSP_CLOCK  (2 unrouted)
ICSP_DATA  (2 unrouted)
LED1  (1 unrouted)
  Top 0.305: U$1.3 57.33,35.38 60.96,31.75 60.96,26.67 63.5,24.13 67.31,24.13 JP11.3
LED2  (2 unrouted)
  Top 0.305: JP11.4 63.5,25.4 62.23,26.67
MCLR  (3 unrouted)
N$1  (2 unrouted)
N$2  (1 unrouted)
N$3  (1 unrouted)
N$4  (1 unrouted)
N$5  (2 unrouted)
N$6  (1 unrouted)
N$7  (1 unrouted)
N$8  (1 unrouted)
N$9  (1 unrouted)
N$10  (1 unrouted)
N$11  (1 unrouted)
N$12  (1 unrouted)
N$13  (4 unrouted)
N$14  (1 unrouted)
N$15  (1 unrouted)
N$16  (1 unrouted)
OSCI  (3 unrouted)
OSCO  (3 unrouted)
PAD_CAP1  (2 unrouted)
PAD_CAP2  (2 unrouted)
PAD_CAP3  (2 unrouted)
PAD_CAP4  (2 unrouted)
PAD_CAP5  (2 unrouted)
RD  (1 unrouted)
  Top 0.254: U$1.97 50.6,30.05 57.15,23.5 JP14.22
REST  (2 unrouted)
RS  (1 unrouted)
  Top 0.305: U$1.1 55.6,34.57 58.42,29.21 58.42,26.67 63.5,21.59 67.31,21.59 JP11.1
SD_CS  (2 unrouted)
SD_DIN(F_SO)  (2 unrouted)
SD_OUT(F_SI)  (2 unrouted)
SD_SCK(F_SCK)  (2 unrouted)
SOSCI  (3 unrouted)
SOSCO  (3 unrouted)
USBID  (2 unrouted)
VBUS  (5 unrouted)
WR  (1 unrouted)
  Top 0.254: U$1.96 50.19,29.82 55.88,24.13 55.88,17.14 56.52,16.51 JP14.21
(copper drawn outside any net)
  shapes: Top area x1, Top circle x5